# EAGLE schematic Rx_V2-2 (EAGLE 9.6.2)
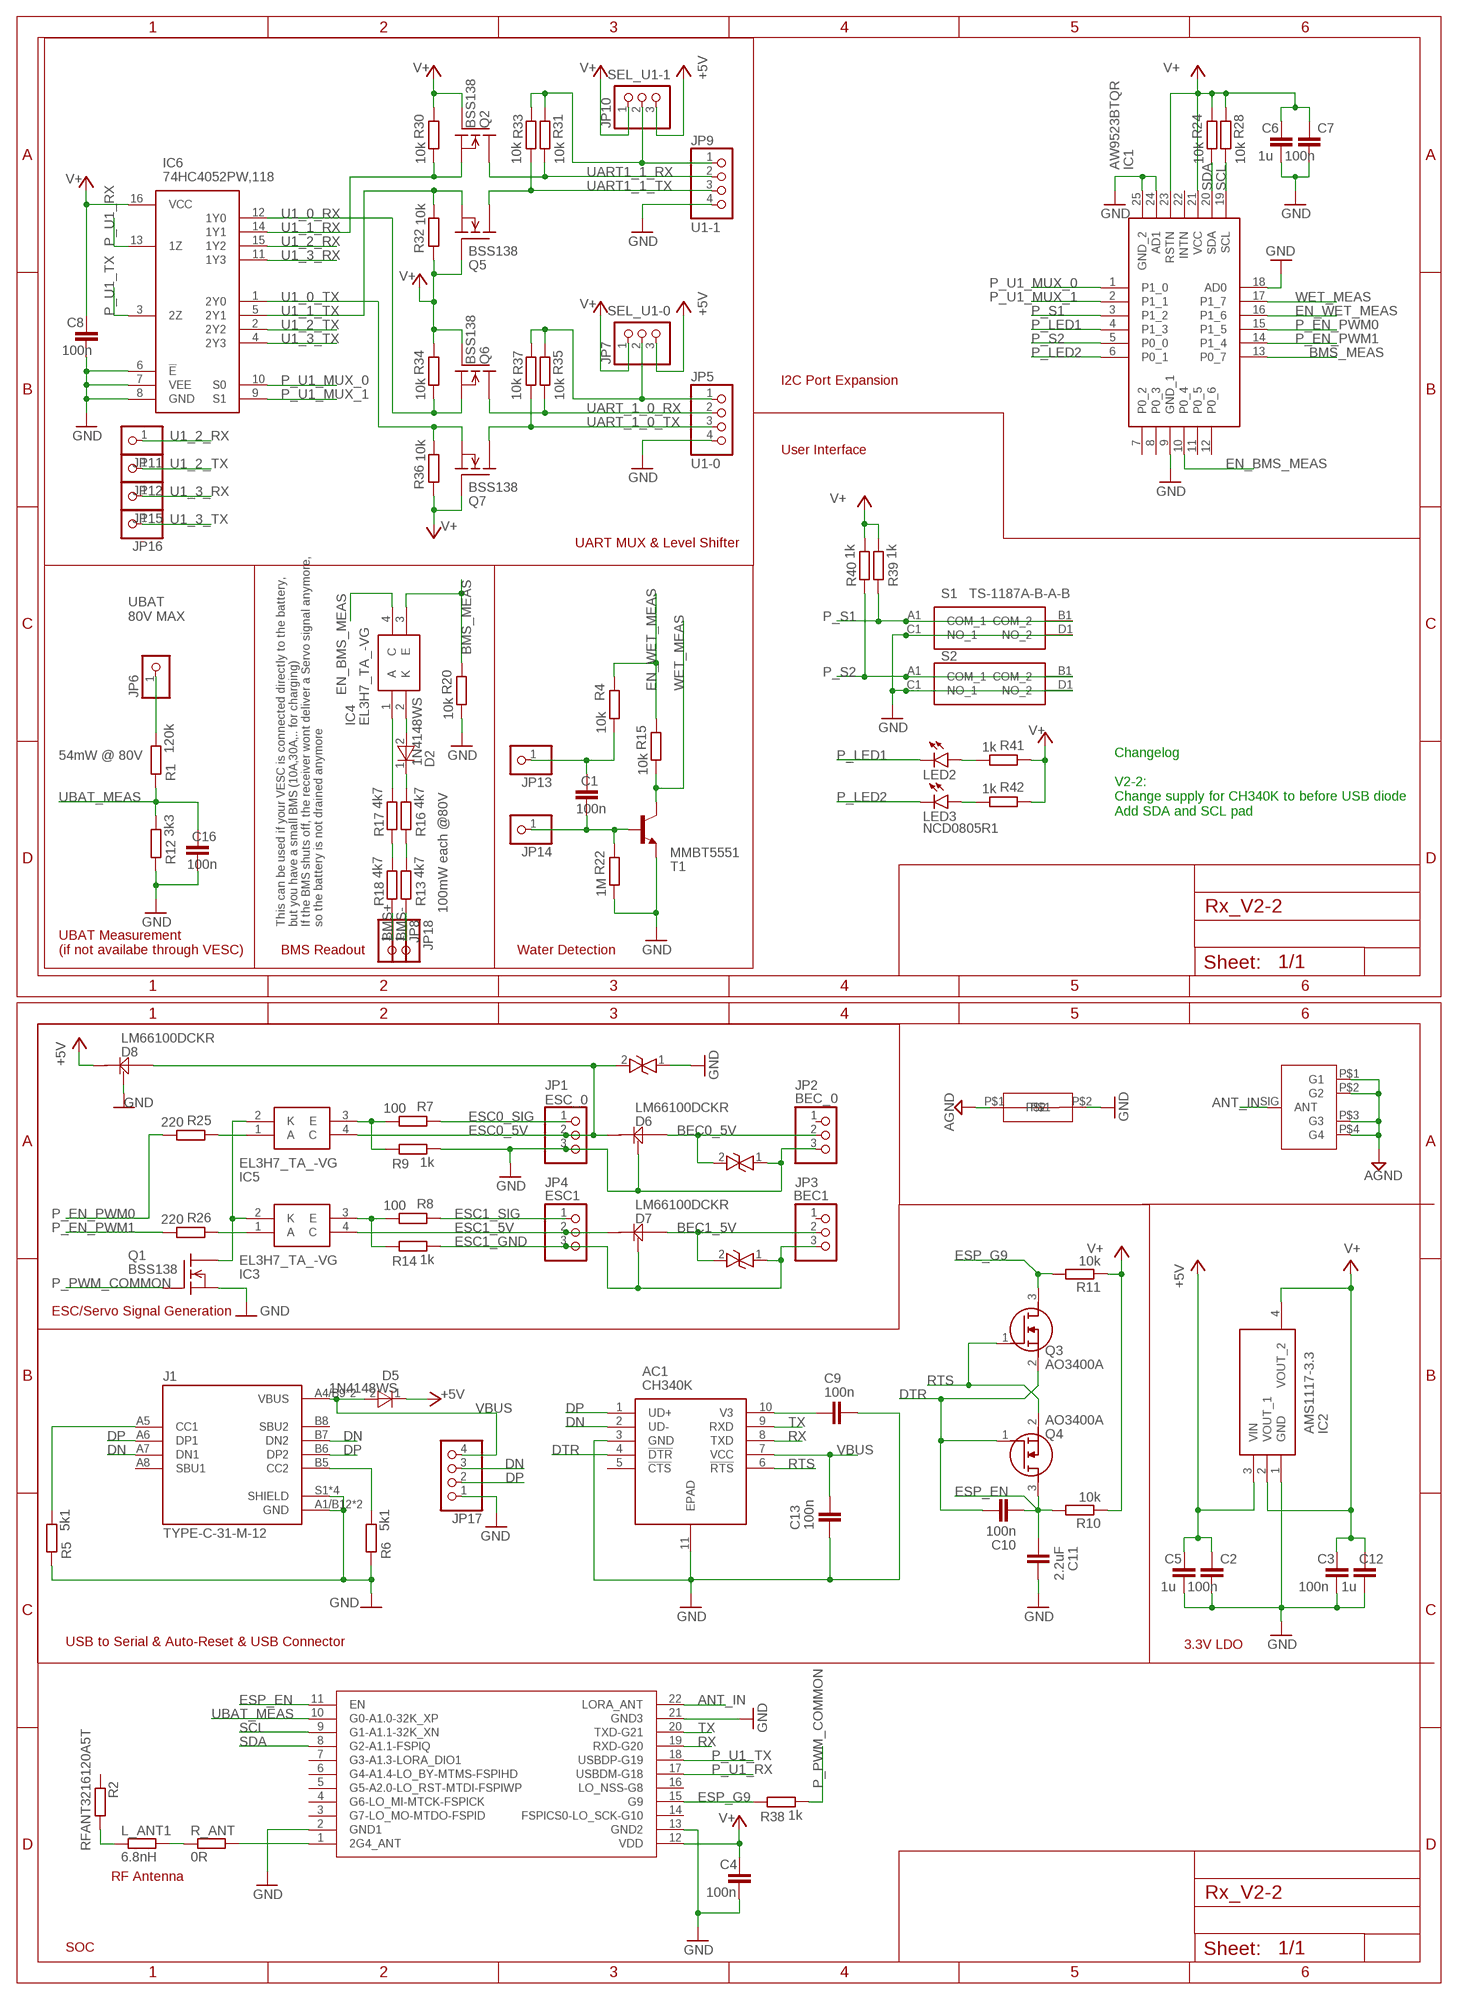
[diagram p0: schematic, sheet 1, part 1 of 2]
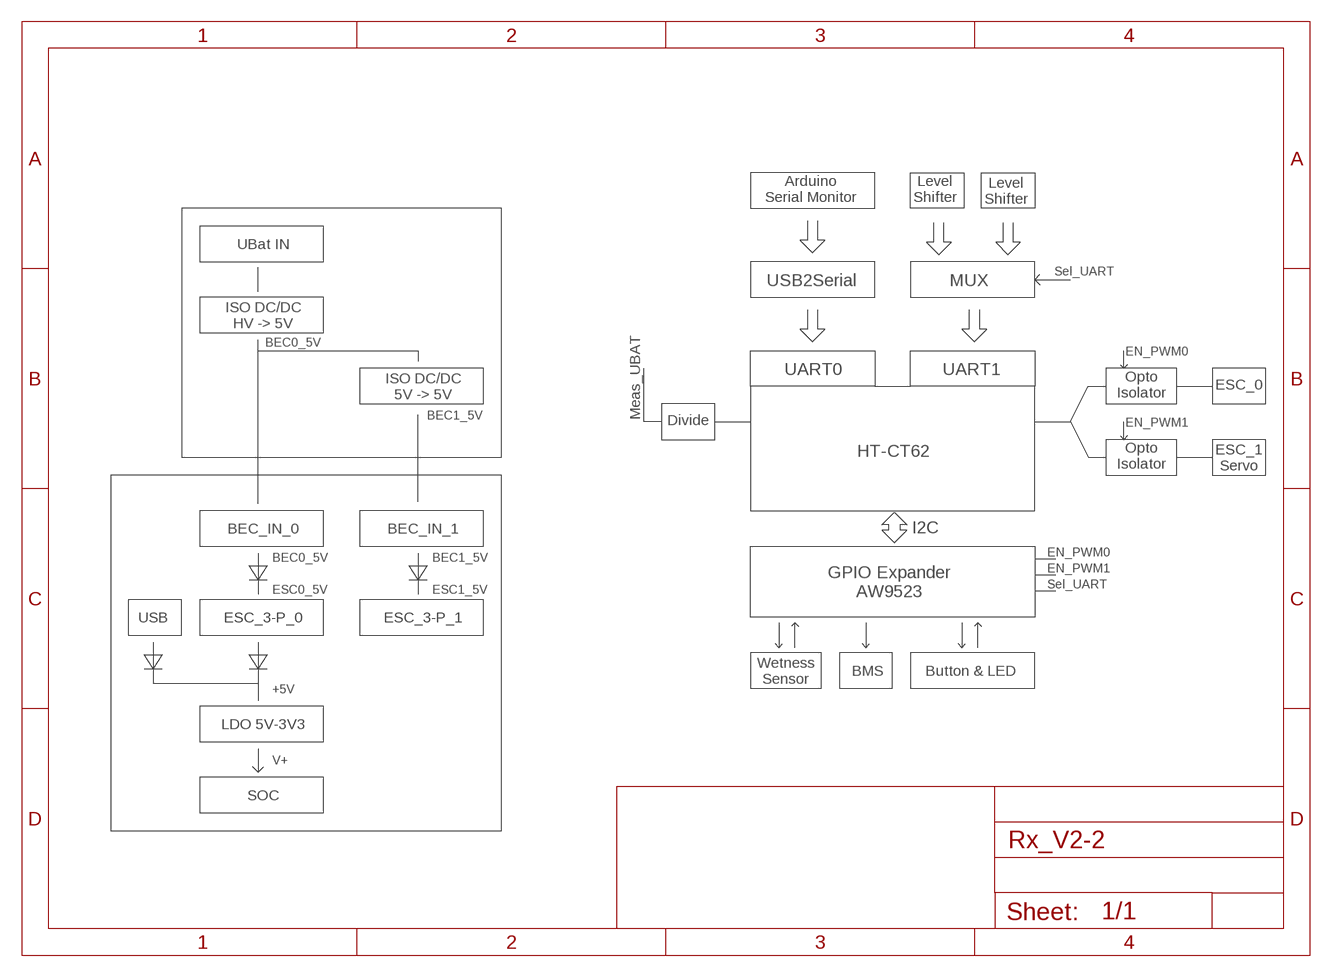
[diagram p1: schematic, sheet 1, part 2 of 2]

## Parts
AC1  CH340K  [SOP100P600X180-11N]
C1  100n  C-EUC0603  [C0603]
C2  100n  C-EUC0603  [C0603]
C3  100n  C-EUC0603  [C0603]
C4  100n  C-EUC0603  [C0603]
C5  1u  C-EUC0603  [C0603]
C6  1u  C-EUC0603  [C0603]
C7  100n  C-EUC0603  [C0603]
C8  100n  C-EUC0603  [C0603]
C9  100n  C-EUC0603  [C0603]
C10  100n  C-EUC0603  [C0603]
C11  2.2uF  C-EUC0603  [C0603]
C12  1u  C-EUC0603  [C0603]
C13  100n  C-EUC0603  [C0603]
C16  100n  C-EUC0603  [C0603]
D1  P6SMB6.8CA  [DIONM5436X261N]
D2  1N4148WS  [SODFL2512X90N]
D3  P6SMB6.8CA  [DIONM5436X261N]
D4  P6SMB6.8CA  [DIONM5436X261N]
D5  1N4148WS  [SODFL2512X90N]
D6  LM66100DCKR  [SOP65P210X110-6N]
D7  LM66100DCKR  [SOP65P210X110-6N]
D8  LM66100DCKR  [SOP65P210X110-6N]
IC1  AW9523BTQR  [QFN50P400X400X80-25N]
IC2  AMS1117-3.3  [SOT229P700X180-4N]
IC3  EL3H7_TA_-VG  [SOIC127P700X200-4N]
IC4  EL3H7_TA_-VG  [SOIC127P700X200-4N]
IC5  EL3H7_TA_-VG  [SOIC127P700X200-4N]
IC6  74HC4052PW,118  [SOP65P640X110-16N]
J1  TYPE-C-31-M-12  [HRO_TYPE-C-31-M-12]
JP1  ESC_0  PINHD-1X3  [1X03]
JP2  BEC_0  PINHD-1X3  [1X03]
JP3  BEC1  PINHD-1X3  [1X03]
JP4  ESC1  PINHD-1X3  [1X03]
JP5  U1-0  PINHD-1X4  [1X04]
JP6  PINHD-1X1  [1X01]
JP7  SEL_U1-0  PINHD-1X3  [1X03]
JP8  PINHD-1X1  [1X01]
JP9  U1-1  PINHD-1X4  [1X04]
JP10  SEL_U1-1  PINHD-1X3  [1X03]
JP11  PINHD-1X1  [1X01]
JP12  PINHD-1X1  [1X01]
JP13  PINHD-1X1  [1X01]
JP14  PINHD-1X1  [1X01]
JP15  PINHD-1X1  [1X01]
JP16  PINHD-1X1  [1X01]
JP17  PINHD-1X4  [1X04]
JP18  PINHD-1X1  [1X01]
L_ANT1  6.8nH  R-EU_R0402  [R0402]
LED2  NCD0805R1  LEDCHIP-LED0805  [CHIP-LED0805]
LED3  NCD0805R1  LEDCHIP-LED0805  [CHIP-LED0805]
Q1  BSS138  [SOT23]
Q2  BSS138  [SOT23]
Q3  AO3400A  [SOT95P280X125-3N]
Q4  AO3400A  [SOT95P280X125-3N]
Q5  BSS138  [SOT23]
Q6  BSS138  [SOT23]
Q7  BSS138  [SOT23]
R1  120k  R-EU_R0603  [R0603]
R2  RFANT3216120A5T  R-EU_R1206  [R1206]
R4  10k  R-EU_R0603  [R0603]
R5  5k1  R-EU_R0603  [R0603]
R6  5k1  R-EU_R0603  [R0603]
R7  100  R-EU_R0603  [R0603]
R8  100  R-EU_R0603  [R0603]
R9  1k  R-EU_R0603  [R0603]
R10  10k  R-EU_R0603  [R0603]
R11  10k  R-EU_R0603  [R0603]
R12  3k3  R-EU_R0603  [R0603]
R13  4k7  R-EU_R0603  [R0603]
R14  1k  R-EU_R0603  [R0603]
R15  10k  R-EU_R0603  [R0603]
R16  4k7  R-EU_R0603  [R0603]
R17  4k7  R-EU_R0603  [R0603]
R18  4k7  R-EU_R0603  [R0603]
R20  10k  R-EU_R0603  [R0603]
R22  1M  R-EU_R0603  [R0603]
R24  10k  R-EU_R0603  [R0603]
R25  220  R-EU_R0603  [R0603]
R26  220  R-EU_R0603  [R0603]
R28  10k  R-EU_R0603  [R0603]
R30  10k  R-EU_R0603  [R0603]
R31  10k  R-EU_R0603  [R0603]
R32  10k  R-EU_R0603  [R0603]
R33  10k  R-EU_R0603  [R0603]
R34  10k  R-EU_R0603  [R0603]
R35  10k  R-EU_R0603  [R0603]
R36  10k  R-EU_R0603  [R0603]
R37  10k  R-EU_R0603  [R0603]
R38  1k  R-EU_R0603  [R0603]
R39  1k  R-EU_R0603  [R0603]
R40  1k  R-EU_R0603  [R0603]
R41  1k  R-EU_R0603  [R0603]
R42  1k  R-EU_R0603  [R0603]
R_ANT  0R  R-EU_R0402  [R0402]
S1  TS-1187A-B-A-B  [TS1187ABAB]
S2  TS-1187A-B-A-B  [TS1187ABAB]
T1  MMBT5551  BC847B-NPN-SOT23-BEC  [SOT23-BEC]
U$1  SMA_5.08_1.4  [SMA_5.08_1.4]
U$5  HT-CT62  [HT-CT62]
U$7  NETTIE_0.6MM  [0.6MM]

## Nets
+5V: C2.1 C5.1 D5.1(K) D8.3(VOUT) D8.6(VOUT) IC2.3(VIN) JP7.3 JP10.3
AGND: U$1.P$1(G1) U$1.P$2(G2) U$1.P$3(G3) U$1.P$4(G4) U$7.P$1
ANT_IN: U$1.SIG(ANT) U$5.22(LORA_ANT)
BEC0_5V: D1.2 D6.1(VIN) JP2.2
BEC1_5V: D3.2 D7.1(VIN) JP3.2
BMS+: JP8.1 R18.1
BMS-: JP18.1 R13.1
BMS_MEAS: IC1.13(P0_7) IC4.3(E) R20.1
DN: AC1.2(UD-) J1.A7(DN1) J1.B7(DN2) JP17.3
DP: AC1.1(UD+) J1.A6(DP1) J1.B6(DP2) JP17.2
DTR: AC1.4(!DTR) C10.1 Q3.2(S) Q4.1(G)
EN_BMS_MEAS: IC1.10(P0_4) IC4.4(C)
EN_WET_MEAS: IC1.16(P1_6) R4.1 R15.1
ESC0_5V: D4.2 D6.3(VOUT) D6.6(VOUT) D8.1(VIN) IC5.4(C) JP1.2
ESC0_SIG: JP1.1 R7.1
ESC1_5V: D7.3(VOUT) D7.6(VOUT) IC3.4(C) JP4.2
ESC1_GND: D3.1 D7.2(GND) D7.4(GND) D7.5(GND) JP3.3 JP4.3 R14.2
ESC1_SIG: JP4.1 R8.1
ESP_EN: C10.2 C11.2 Q4.3(D) R10.2 U$5.11(EN)
ESP_G9: Q3.3(D) R11.2 R38.1 U$5.15(G9)
GND: AC1.3(GND) AC1.11(EPAD) C2.2 C3.2 C4.2 C5.2 C6.2 C7.2 C8.2 C9.1 C11.1 C12.2 C13.2 C16.2 D1.1 D4.1 D6.2(GND) D6.4(GND) D6.5(GND) D8.2(GND) D8.4(GND) D8.5(GND) IC1.9(GND_1) IC1.18(AD0) IC1.24(AD1) IC1.25(GND_2) IC2.1(GND) IC6.6(!E) IC6.7(VEE) IC6.8(GND) J1.A1/B12(GND) J1.B1/A12(GND) J1.S1(SHIELD) J1.S2(SHIELD) J1.S3(SHIELD) J1.S4(SHIELD) JP1.3 JP2.3 JP5.4 JP9.4 JP17.1 Q1.2(S) R5.1 R6.1 R9.2 R12.1 R20.2 R22.2 S1.C1(NO_1) S1.D1(NO_2) S2.C1(NO_1) S2.D1(NO_2) T1.E U$5.2(GND1) U$5.13(GND2) U$5.21(GND3) U$7.P$2
N$1: L_ANT1.2 R2.2
N$2: R_ANT.1 U$5.1(2G4_ANT)
N$3: LED2.A R41.2
N$4: J1.A5(CC1) R5.2
N$5: IC4.1(A) R17.2
N$6: L_ANT1.1 R_ANT.2
N$7: IC5.3(E) R7.2 R9.1
N$10: J1.B5(CC2) R6.2
N$11: IC3.3(E) R8.2 R14.1
N$12: LED3.A R42.2
N$14: D2.1(K) R16.2
N$15: JP6.1 R1.2
N$16: D2.2(A) IC4.2(K)
N$17: C1.2 JP14.1 R22.1 T1.B
N$18: C1.1 JP13.1 R4.2
N$20: IC3.2(K) IC5.2(K) Q1.3(D)
N$21: R13.2 R16.1
N$22: AC1.10(V3) C9.2
N$23: R17.1 R18.2
N$24: IC5.1(A) R25.1
N$25: IC3.1(A) R26.1
N$29: JP9.1 JP10.2 R31.1 R33.1
N$31: JP5.1 JP7.2 R35.1 R37.1
P_EN_PWM0: IC1.15(P1_5) R25.2
P_EN_PWM1: IC1.14(P1_4) R26.2
P_LED1: IC1.4(P1_3) LED2.C
P_LED2: IC1.6(P0_1) LED3.C
P_PWM_COMMON: Q1.1(G) R38.2
P_S1: IC1.3(P1_2) R39.1 S1.A1(COM_1) S1.B1(COM_2)
P_S2: IC1.5(P0_0) R40.1 S2.A1(COM_1) S2.B1(COM_2)
P_U1_MUX_0: IC1.1(P1_0) IC6.10(S0)
P_U1_MUX_1: IC1.2(P1_1) IC6.9(S1)
P_U1_RX: IC6.13(1Z) U$5.17(USBDM-G18)
P_U1_TX: IC6.3(2Z) U$5.18(USBDP-G19)
RTS: AC1.6(!RTS) Q3.1(G) Q4.2(S)
RX: AC1.8(TXD) U$5.19(RXD-G20)
SCL: IC1.19(SCL) R28.2 U$5.9(G1-A1.1-32K_XN)
SDA: IC1.20(SDA) R24.2 U$5.8(G2-A1.1-FSPIQ)
TX: AC1.9(RXD) U$5.20(TXD-G21)
U1_0_RX: IC6.12(1Y0) Q6.2(S) R34.2
U1_0_TX: IC6.1(2Y0) Q7.2(S) R36.2
U1_1_RX: IC6.14(1Y1) Q2.2(S) R30.2
U1_1_TX: IC6.5(2Y1) Q5.2(S) R32.2
U1_2_RX: IC6.15(1Y2) JP11.1
U1_2_TX: IC6.2(2Y2) JP12.1
U1_3_RX: IC6.11(1Y3) JP15.1
U1_3_TX: IC6.4(2Y3) JP16.1
UART1_1_RX: JP9.2 Q2.3(D) R31.2
UART1_1_TX: JP9.3 Q5.3(D) R33.2
UART_1_0_RX: JP5.2 Q6.3(D) R35.2
UART_1_0_TX: JP5.3 Q7.3(D) R37.2
UBAT_MEAS: C16.1 R1.1 R12.2 U$5.10(G0-A1.0-32K_XP)
V+: C3.1 C4.1 C6.1 C7.1 C8.1 C12.1 IC1.21(VCC) IC1.23(RSTN) IC2.2(VOUT_1) IC2.4(VOUT_2) IC6.16(VCC) JP7.1 JP10.1 Q2.1(G) Q5.1(G) Q6.1(G) Q7.1(G) R10.1 R11.1 R24.1 R28.1 R30.1 R32.1 R34.1 R36.1 R39.2 R40.2 R41.1 R42.1 U$5.12(VDD)
VBUS: AC1.7(VCC) C13.1 D5.2(A) J1.A4/B9(VBUS) J1.B4/A9(VBUS) JP17.4
WET_MEAS: IC1.17(P1_7) R15.2 T1.C
Unconnected: AC1.5(!CTS) IC1.7(P0_2) IC1.8(P0_3) IC1.11(P0_5) IC1.12(P0_6) IC1.22(INTN) J1.A8(SBU1) J1.B8(SBU2) JP2.1 JP3.1 R2.1 U$5.3(G7-LO_MO-MTDO-FSPID) U$5.4(G6-LO_MI-MTCK-FSPICK) U$5.5(G5-A2.0-LO_RST-MTDI-FSPIWP) U$5.6(G4-A1.4-LO_BY-MTMS-FSPIHD) U$5.7(G3-A1.3-LORA_DIO1) U$5.14(FSPICS0-LO_SCK-G10) U$5.16(LO_NSS-G8)

## Notes on the sheet
- I2C Port Expansion
- User Interface
- UART MUX & Level Shifter
- UBAT
  80V MAX
- 54mW @ 80V
- Changelog
  
  V2-2:
  Change supply for CH340K to before USB diode
  Add SDA and SCL pad
- 100mW each @80V
- This can be used if your VESC is connected directly to the battery,
  but you have a small BMS (10A,30A,.. for charging)
  If the BMS shuts off, the receiver wont deliver a Servo signal anymore,
  so the battery is not drained anymore
- UBAT Measurement
  (if not availabe through VESC)
- BMS Readout | Water Detection
- ESC/Servo Signal Generation
- USB to Serial & Auto-Reset & USB Connector | 3.3V LDO
- RF Antenna
- SOC
- Arduino
  Serial Monitor
- Level
  Shifter
- Level
  Shifter
- UBat IN
- Sel_UART
- USB2Serial | MUX
- ISO DC/DC
  HV -> 5V
- BEC0_5V
- EN_PWM0
- Meas_UBAT | UART0 | UART1
- Opto
  Isolator
- ESC_0
- ISO DC/DC
  5V -> 5V
- BEC1_5V | Divide
- EN_PWM1
- Opto
  Isolator
- HT-CT62
- ESC_1
  Servo
- BEC_IN_0 | BEC_IN_1
- I2C
- EN_PWM0
- BEC0_5V | BEC1_5V
- EN_PWM1
- GPIO Expander
  AW9523
- Sel_UART
- ESC0_5V | ESC1_5V
- USB | ESC_3-P_0 | ESC_3-P_1
- Wetness
  Sensor
- BMS | Button & LED
- +5V
- LDO 5V-3V3
- V+
- SOC

## Library data of the parts
AC1 = CH340K:CH340K: CH340 USB2Serial Source: Datasheet <https://akizukidenshi.com/download/ds/wch/ch340.pdf>; DESCRIPTION: CH340 USB2Serial; HEIGHT: 1.8mm; MANUFACTURER_NAME: WCH; MANUFACTURER_PART_NUMBER: CH340K
C1-C13 C16 = rcl:C-EU: CAPACITOR, European symbol; SPICEPREFIX: C
D1 D3 D4 = P6SMB6.8CA:P6SMB6.8CA: Littelfuse P6SMB6.8CA, Bi-Directional TVS Diode, 600W, 2-Pin DO-214AA Source: Datasheet <https://componentsearchengine.com/Datasheets/2/P6SMB6.8CA.pdf>; ARROW_PART_NUMBER: P6SMB6.8CA; ARROW_PRICE-STOCK: https://www.arrow.com/en/products/p6smb6.8ca/littelfuse?region=nac; DESCRIPTION: Littelfuse P6SMB6.8CA, Bi-Directional TVS Diode, 600W, 2-Pin DO-214AA; HEIGHT: 2.61mm; MANUFACTURER_NAME: LITTELFUSE; MANUFACTURER_PART_NUMBER: P6SMB6.8CA; MOUSER_PART_NUMBER: 576-P6SMB6.8CA; MOUSER_PRICE-STOCK: https://www.mouser.co.uk/ProductDetail/Littelfuse/P6SMB6.8CA?qs=3K5NeMAIBDkbaiJnSI65Ag%3D%3D
D2 D5 = 1N4148WS:1N4148WS: ON Semiconductor Switching Diode, 300mA 75V, 2-Pin SOD-323 1N4148WS Source: Datasheet; ARROW_PART_NUMBER: 1N4148WS; ARROW_PRICE-STOCK: https://www.arrow.com/en/products/1n4148ws/on-semiconductor?region=nac; DESCRIPTION: ON Semiconductor Switching Diode, 300mA 75V, 2-Pin SOD-323 1N4148WS; HEIGHT: 0.9mm; MANUFACTURER_NAME: onsemi; MANUFACTURER_PART_NUMBER: 1N4148WS; MOUSER_PART_NUMBER: 512-1N4148WS; MOUSER_PRICE-STOCK: https://www.mouser.co.uk/ProductDetail/ON-Semiconductor-Fairchild/1N4148WS?qs=2%2FYqgE%252BHg%252BKBrKZlAsMLhw%3D%3D
D6-D8 = LM66100DCKR:LM66100DCKR: +/-6-V, Low IQ ideal diode with input polarity protection Source: Datasheet <http://www.ti.com/lit/gpn/LM66100>; ARROW_PART_NUMBER: LM66100DCKR; ARROW_PRICE-STOCK: https://www.arrow.com/en/products/lm66100dckr/texas-instruments?region=nac; DESCRIPTION: +/-6-V, Low IQ ideal diode with input polarity protection; HEIGHT: 1.1mm; MANUFACTURER_NAME: Texas Instruments; MANUFACTURER_PART_NUMBER: LM66100DCKR; MOUSER_PART_NUMBER: 595-LM66100DCKR; MOUSER_PRICE-STOCK: https://www.mouser.co.uk/ProductDetail/Texas-Instruments/LM66100DCKR?qs=vLWxofP3U2y2yPPrXoBBoA%3D%3D
IC1 = AW9523BTQR:AW9523BTQR: 16 MULTI-FUNCTION LED DRIVER AND GPIO CONTROLLER WITH I2C INTERFACE Source: Datasheet <https://www.alldatasheet.net/datasheet-pdf/pdf/1148543/AWINIC/AW9523BTQR.html>; DESCRIPTION: 16 MULTI-FUNCTION LED DRIVER AND GPIO CONTROLLER WITH I2C INTERFACE; HEIGHT: 0.8mm; MANUFACTURER_NAME: AWINIC; MANUFACTURER_PART_NUMBER: AW9523BTQR
IC2 = AMS1117-3.3:AMS1117-3.3: 1A LOW DROPOUT VOLTAGE REGULATOR, SOT-223 Source: Datasheet <http://www.advanced-monolithic.com/pdf/ds1117.pdf>; DESCRIPTION: 1A LOW DROPOUT VOLTAGE REGULATOR, SOT-223; HEIGHT: 1.8mm; MANUFACTURER_NAME: Advanced Monolithic Systems; MANUFACTURER_PART_NUMBER: AMS1117-3.3
IC3-IC5 = EL3H7_TA_-VG:EL3H7_TA_-VG: Transistor Output Optocouplers 50-600CTR 3750Vrms -55 to +110 Op Temp Source: Datasheet <https://everlightamericas.com/index.php?controller=attachment&id_attachment=2584>; ARROW_PART_NUMBER: EL3H7(TA)-VG; ARROW_PRICE-STOCK: https://www.arrow.com/en/products/el3h7-ta-vg/everlight-electronics?region=nac; DESCRIPTION: Transistor Output Optocouplers 50-600CTR 3750Vrms -55 to +110 Op Temp; HEIGHT: 2mm; MANUFACTURER_NAME: Everlight; MANUFACTURER_PART_NUMBER: EL3H7(TA)-VG; MOUSER_PART_NUMBER: 638-EL3H7TAVG; MOUSER_PRICE-STOCK: https://www.mouser.co.uk/ProductDetail/Everlight/EL3H7TA-VG?qs=8PzhAHr7IdOgYIKe3kw%2F8Q%3D%3D
IC6 = 74HC4052PW_118:74HC4052PW,118: 74HC(T)4052 - Dual 4-channel analog multiplexer/demultiplexer@en-us Source: Datasheet <https://assets.nexperia.com/documents/data-sheet/74HC_HCT4052.pdf>; ARROW_PART_NUMBER: 74HC4052PW,118; ARROW_PRICE-STOCK: https://www.arrow.com/en/products/74hc4052pw118/nexperia?utm_currency=USD&region=nac; DESCRIPTION: 74HC(T)4052 - Dual 4-channel analog multiplexer/demultiplexer@en-us; HEIGHT: 1.1mm; MANUFACTURER_NAME: Nexperia; MANUFACTURER_PART_NUMBER: 74HC4052PW,118; MOUSER_PART_NUMBER: 771-74HC4052PW-T; MOUSER_PRICE-STOCK: https://www.mouser.co.uk/ProductDetail/Nexperia/74HC4052PW118?qs=P62ublwmbi%2Fhh72g3HnbZg%3D%3D
J1 = TYPE-C-31-M-12:TYPE-C-31-M-12: Check availability <https://pricing.snapeda.com/parts/TYPE-C-31-M-12/HRO%20Electronics%20Co.%2C%20Ltd./view-part?ref=eda>; AVAILABILITY: Not in stock; DESCRIPTION: USB Connectors 24 Receptacle 1 8.94*7.3mm RoHS; MF: HRO Electronics Co., Ltd.; MP: TYPE-C-31-M-12; PACKAGE: Package; PRICE: None
JP1-JP4 JP7 JP10 = pinhead:PINHD-1X3: PIN HEADER
JP5 JP9 JP17 = pinhead:PINHD-1X4: PIN HEADER
JP6 JP8 JP11-JP16 JP18 = pinhead:PINHD-1X1: PIN HEADER
L_ANT1 R1 R2 R4-R18 R20 R22 R24-R26 R28 R30-R42 R_ANT = rcl:R-EU_: RESISTOR, European symbol; SPICEPREFIX: R
LED2 LED3 = led:LED: LED OSRAM: - CHIPLED LG R971, LG N971, LY N971, LG Q971, LY Q971, LO R971, LY R971 LH N974, LH R974 LS Q976, LO Q976, LY Q976 LO Q996 - Hyper CHIPLED LW Q18S LB Q993, LB Q99A, LB R99A - SideLED LS A670, LO A670, LY A670, LG A670, LP A670 LB A673, LV A673, LT A673, LW A673 LH A674 LY A675 LS A676, LA A676, LO A676, LY A676, LW A676 LS A679, LY A679, LG A679 - Hyper Micro SIDELED® LS Y876, LA Y876, LO Y876, LY Y876 LT Y87S - SmartLED LW L88C, LW L88S LB L89C, LB L89S, LG L890 LS L89K, LO L89K, LY L89K LS L896, LA L896, LO L896, LY L896 - TOPLED LS T670, LO T670, LY T670, LG T670, LP T670 LSG T670, LSP T670, LSY T670, LOP T670, LYG T670 LG T671, LOG T671, LSG T671 LB T673, LV T673, LT T673, LW T673 LH T674 LS T676, LA T676, LO T676, LY T676, LB T676, LH T676, LSB T676, LW T676 LB T67C, LV T67C, LT T67C, LS T67K, LO T67K, LY T67K, LW E67C LS E67B, LA E67B, LO E67B, LY E67B, LB E67C, LV E67C, LT E67C LW T67C LS T679, LY T679, LG T679 LS T770, LO T770, LY T770, LG T770, LP T770 LB T773, LV T773, LT T773, LW T773 LH T774 LS E675, LA E675, LY E675, LS T675 LS T776, LA T776, LO T776, LY T776, LB T776 LHGB T686 LT T68C, LB T68C - Hyper Mini TOPLED® LB M676 - Mini TOPLED Santana® LG M470 LS M47K, LO M47K, LY M47K Source: http://www.osram.convergy.de LUXEON: - LUMILED® LXK2-PW12-R00, LXK2-PW12-S00, LXK2-PW14-U00, LXK2-PW14-V00 LXK2-PM12-R00, LXK2-PM12-S00, LXK2-PM14-U00 LXK2-PE12-Q00, LXK2-PE12-R00, LXK2-PE12-S00, LXK2-PE14-T00, LXK2-PE14-U00 LXK2-PB12-K00, LXK2-PB12-L00, LXK2-PB12-M00, LXK2-PB14-N00, LXK2-PB14-P00, LXK2-PB14-Q00 LXK2-PR12-L00, LXK2-PR12-M00, LXK2-PR14-Q00, LXK2-PR14-R00 LXK2-PD12-Q00, LXK2-PD12-R00, LXK2-PD12-S00 LXK2-PH12-R00, LXK2-PH12-S00 LXK2-PL12-P00, LXK2-PL12-Q00, LXK2-PL12-R00 Source: www.luxeon.com KINGBRIGHT: KA-3528ASYC Source: www.kingbright.com
Q1 Q2 Q5-Q7 = transistor-fet:BSS138: N-Channel Enhancement MOSFET 200V; 0,16A; 11Ohm
Q3 Q4 = AO3400A:AO3400A: 30V N-Channel MOSFET Source: Datasheet <http://aosmd.com/res/data_sheets/AO3400A.pdf>; ARROW_PART_NUMBER: AO3400A; ARROW_PRICE-STOCK: https://www.arrow.com/en/products/ao3400a/alpha-and-omega-semiconductor?region=nac; DESCRIPTION: 30V N-Channel MOSFET; HEIGHT: 1.25mm; MANUFACTURER_NAME: Alpha & Omega Semiconductors; MANUFACTURER_PART_NUMBER: AO3400A
S1 S2 = TS-1187A-B-A-B:TS-1187A-B-A-B: tact switch 4x4X1.5 patch 160GF metal head waterproof Source: Datasheet <http://www.helloxkb.com/public/images/pdf/TS-1187A-X-X-X.pdf>; DESCRIPTION: tact switch 4x4X1.5 patch 160GF metal head waterproof; HEIGHT: 4.05mm; MANUFACTURER_NAME: XKB Connectivity; MANUFACTURER_PART_NUMBER: TS-1187A-B-A-B
T1 = transistor:*-NPN-: NPN Transistror BF959 corrected 2008.03.06
U$1 = SMA:SMA_5.08_1.4
U$5 = HT-CT62:HT-CT62
U$7 = NETTIE:NETTIE_0.6MM